# Altium schematic sheet VoltageBuffers.SchDoc: [Untitled]
size A3; Author: Nędzny Janusz; CompanyName: SensDx S.A.; Organization: SensDx S.A.; Address1: Wrocław Laboratories; SheetNumber: 1; SheetTotal: 1
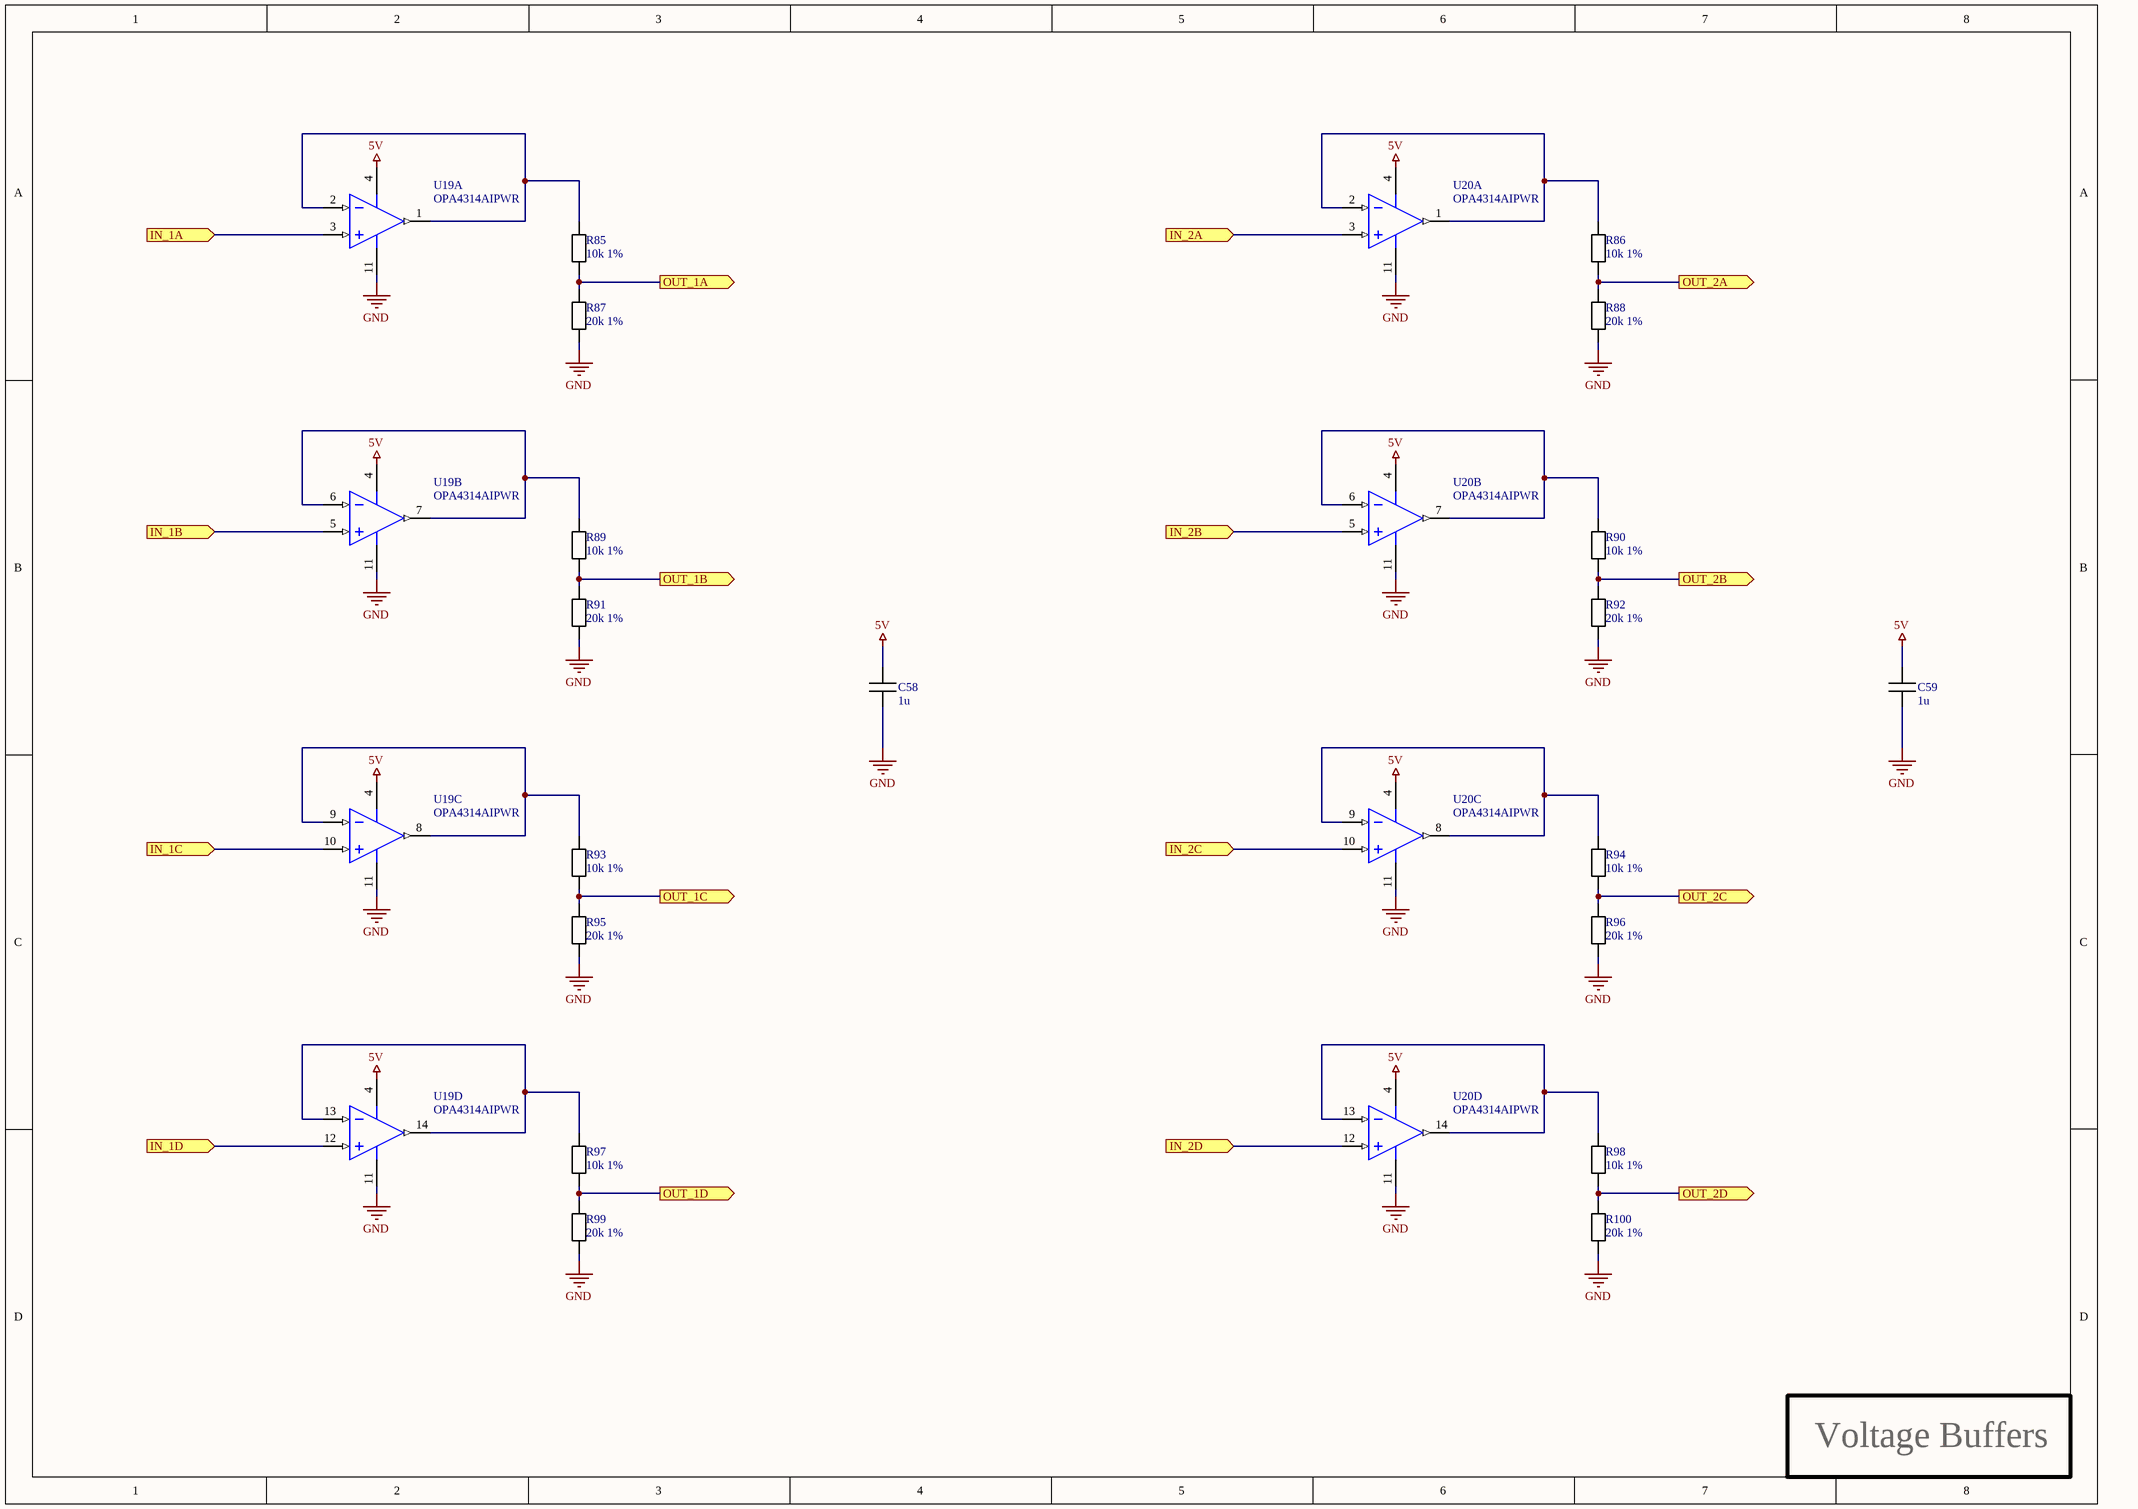
[diagram p0: VoltageBuffers.SchDoc]

## Parts
C58  1u  [C_0603_AUTO]
C59  1u  [C_0603_AUTO]
R85  10k 1%  [R_0603_AUTO]
R86  10k 1%  [R_0603_AUTO]
R87  20k 1%  [R_0603_AUTO]
R88  20k 1%  [R_0603_AUTO]
R89  10k 1%  [R_0603_AUTO]
R90  10k 1%  [R_0603_AUTO]
R91  20k 1%  [R_0603_AUTO]
R92  20k 1%  [R_0603_AUTO]
R93  10k 1%  [R_0603_AUTO]
R94  10k 1%  [R_0603_AUTO]
R95  20k 1%  [R_0603_AUTO]
R96  20k 1%  [R_0603_AUTO]
R97  10k 1%  [R_0603_AUTO]
R98  10k 1%  [R_0603_AUTO]
R99  20k 1%  [R_0603_AUTO]
R100  20k 1%  [R_0603_AUTO]
U19  OPA4314AIPWR  [PW0014A_N]  (parts A,B,C,D of 4)
U20  OPA4314AIPWR  [PW0014A_N]  (parts A,B,C,D of 4)

## Ports
IN_1A (in), IN_1B (in), IN_1C (in), IN_1D (in), IN_2A (in), IN_2B (in), IN_2C (in), IN_2D (in), OUT_1A (out), OUT_1B (out), OUT_1C (out), OUT_1D (out), OUT_2A (out), OUT_2B (out), OUT_2C (out), OUT_2D (out)

## Nets
5V: C58.2 C59.2 U19.4(V+) U20.4(V+)
GND: C58.1 C59.1 R87.1 R88.1 R91.1 R92.1 R95.1 R96.1 R99.1 R100.1 U19.11(V-) U20.11(V-)
IN_1A: U19.3(IN_A+) ; port IN_1A
IN_1B: U19.5(IN_B+) ; port IN_1B
IN_1C: U19.10(IN_C+) ; port IN_1C
IN_1D: U19.12(IN_D+) ; port IN_1D
IN_2A: U20.3(IN_A+) ; port IN_2A
IN_2B: U20.5(IN_B+) ; port IN_2B
IN_2C: U20.10(IN_C+) ; port IN_2C
IN_2D: U20.12(IN_D+) ; port IN_2D
OUT_1A: R85.1 R87.2 ; port OUT_1A
OUT_1B: R89.1 R91.2 ; port OUT_1B
OUT_1C: R93.1 R95.2 ; port OUT_1C
OUT_1D: R97.1 R99.2 ; port OUT_1D
OUT_2A: R86.1 R88.2 ; port OUT_2A
OUT_2B: R90.1 R92.2 ; port OUT_2B
OUT_2C: R94.1 R96.2 ; port OUT_2C
OUT_2D: R98.1 R100.2 ; port OUT_2D
NetR85_2: R85.2 U19.1(OUT_A) U19.2(IN_A-)
NetR86_2: R86.2 U20.1(OUT_A) U20.2(IN_A-)
NetR89_2: R89.2 U19.6(IN_B-) U19.7(OUT_B)
NetR90_2: R90.2 U20.6(IN_B-) U20.7(OUT_B)
NetR93_2: R93.2 U19.8(OUT_C) U19.9(IN_C-)
NetR94_2: R94.2 U20.8(OUT_C) U20.9(IN_C-)
NetR97_2: R97.2 U19.13(IN_D-) U19.14(OUT_D)
NetR98_2: R98.2 U20.13(IN_D-) U20.14(OUT_D)

## Notes on the sheet
- Voltage Buffers
- Title:
- Project name:
- Last modification:
- Author:
- Version control rev.:
- Sheet:
- /
- Sheet size:
- Variant:
- File name:
- A3
- Altium build:

## Library data of the parts
C58 C59 = Capacitor: Manufacturer: [Generic]; MPN: [Generic]; Value: 1u
R85-R100 = Resistor: MPN: [Generic]; Manufacturer: [Generic]
  R85 R86 R89 R90 R93 R94 R97 R98: Value: 10k 1%
  R87 R88 R91 R92 R95 R96 R99 R100: Value: 20k 1%
U19 U20 = CMP-0272-01740-3: Quad 3 MHz, Low-Power, Low-Noise, RRI/O, CMOS Operational Amplifier, 1.8 to 5.5 V, -40 to 125 degC, 14-pin SOP (PW14), Green (RoHS & no Sb/Br); Manufacturer: Texas Instruments; Rating: Catalog; CMRR(Min)(dB): 75; Total Supply Voltage(Max)(+5V is 5, +/-5V is 10): 5.5; GBW(Typ)(MHz): 3; Packing: LARGE T&R; Vio (25C)(Max)(mV): 2.5; Number of Channels: 4; IIB(Max)(pA): 10; Iq per channel(Max)(mA): 0.19; Slew Rate(Typ)(V/us): 1.5; Offset Drift(Typ)(uV/C): 1; Total Supply Voltage(Min)(+5V is 5, +/-5V is 10): 1.8; Sub Family: Low Input Bias Current Amp (<=10pA), Low Power Amp (<=500uA), Low Supply Voltage Amplifier (<=2.7V), Precision Amplifier; ComponentLink2URL: http://www.ti.com/lit/ds/symlink/opa4314.pdf; Code_JEDEC: MO-153; PackageDescription: 14-Pin Plastic Small Outline, Body 5 x 4.4 mm, Pitch 0.65 mm; Eco-Plan: Green (RoHS & no Sb/Br); ComponentLink3Description: Package Specification; DatasheetVersion: SBOS563E; ComponentLink2Description: Datasheet; Mounting Technology: Surface Mount; PackageReference: PW0014A; ComponentLink1Description: Manufacturer URL; ComponentLink3URL: http://www.ti.com/litv/pdf/mpds360; ComponentLink1URL: http://www.ti.com/; PackageVersion: 4040064-3/G, 02/2011; PartNumber: OPA4314AIPWR